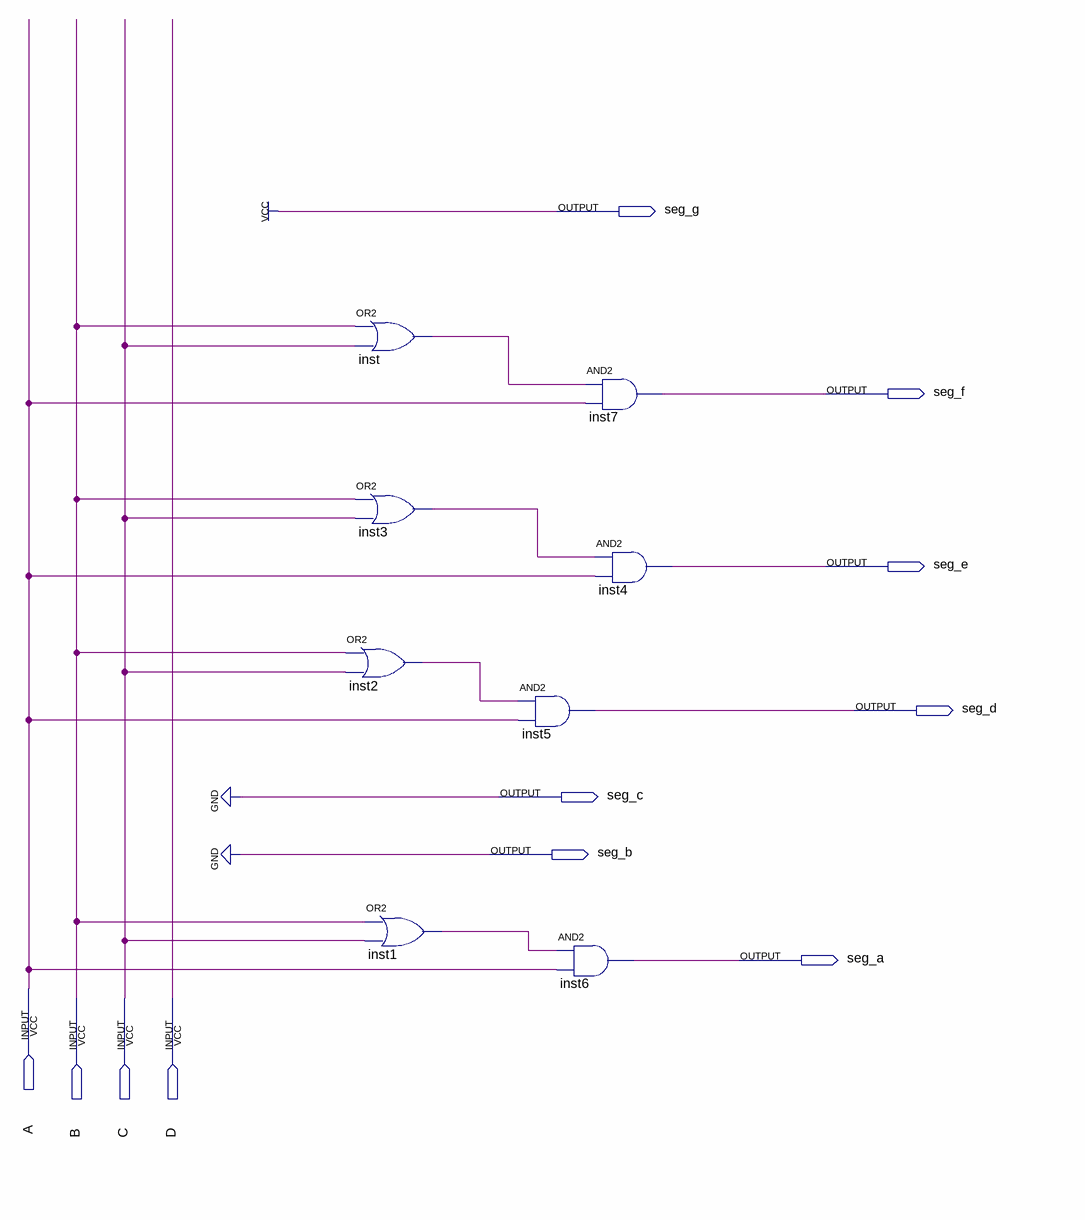
[diagram p0: schematic sheet]
// Quartus schematic decod7seg_ab_dezena.bdf as structural Verilog: 8 symbols, 11 pins
module decod7seg_ab_dezena (
  input  A,
  input  B,
  input  C,
  input  D,
  output seg_g,
  output seg_f,
  output seg_e,
  output seg_d,
  output seg_c,
  output seg_b,
  output seg_a
);

  wire inst1_out, inst2_out, inst3_out, inst_out;

  or inst (inst_out, B, C);
  or inst3 (inst3_out, B, C);
  or inst2 (inst2_out, B, C);
  or inst1 (inst1_out, B, C);
  and inst5 (seg_d, inst2_out, A);
  and inst7 (seg_f, inst_out, A);
  and inst4 (seg_e, inst3_out, A);
  and inst6 (seg_a, inst1_out, A);

  assign seg_b = 1'b0;
  assign seg_c = 1'b0;
  assign seg_g = 1'b1;
endmodule
